# EAGLE design lighting (EAGLE 7.3.0)
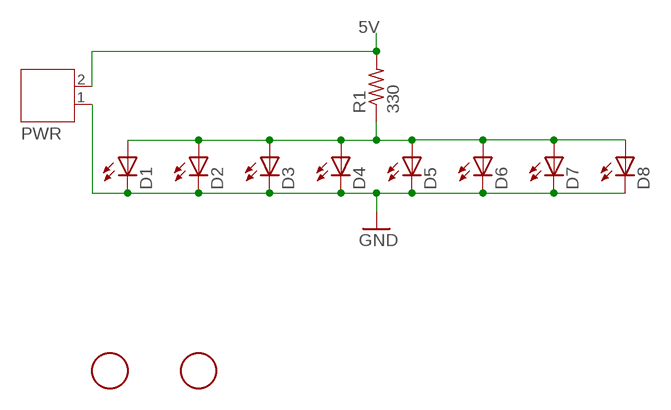
[diagram p0: schematic, sheet 1]

## Parts
D1  LEDCHIPLED_1206  [CHIPLED_1206]
D2  LEDCHIPLED_1206  [CHIPLED_1206]
D3  LEDCHIPLED_1206  [CHIPLED_1206]
D4  LEDCHIPLED_1206  [CHIPLED_1206]
D5  LEDCHIPLED_1206  [CHIPLED_1206]
D6  LEDCHIPLED_1206  [CHIPLED_1206]
D7  LEDCHIPLED_1206  [CHIPLED_1206]
D8  LEDCHIPLED_1206  [CHIPLED_1206]
PWR  JST-PH2  [JST-PH2]
R1  330  R-US_R1206  [R1206]
U$1  FIDUCIAL  [FIDUCIAL_1MM]
U$2  FIDUCIAL  [FIDUCIAL_1MM]

## Nets
5V: PWR.2 R1.2
COMMON: D1.A D2.A D3.A D4.A D5.A D6.A D7.A D8.A R1.1
GND: D1.C D2.C D3.C D4.C D5.C D6.C D7.C D8.C PWR.1

## Library data of the parts
D1-D8 = adafruit:LED: LED OSRAM: - CHIPLED LG R971, LG N971, LY N971, LG Q971, LY Q971, LO R971, LY R971 LH N974, LH R974 LS Q976, LO Q976, LY Q976 LO Q996 - Hyper CHIPLED LW Q18S LB Q993, LB Q99A, LB R99A - SideLED LS A670, LO A670, LY A670, LG A670, LP A670 LB A673, LV A673, LT A673, LW A673 LH A674 LY A675 LS A676, LA A676, LO A676, LY A676, LW A676 LS A679, LY A679, LG A679 - Hyper Micro SIDELED® LS Y876, LA Y876, LO Y876, LY Y876 LT Y87S - SmartLED LW L88C, LW L88S LB L89C, LB L89S, LG L890 LS L89K, LO L89K, LY L89K LS L896, LA L896, LO L896, LY L896 - TOPLED LS T670, LO T670, LY T670, LG T670, LP T670 LSG T670, LSP T670, LSY T670, LOP T670, LYG T670 LG T671, LOG T671, LSG T671 LB T673, LV T673, LT T673, LW T673 LH T674 LS T676, LA T676, LO T676, LY T676, LB T676, LH T676, LSB T676, LW T676 LB T67C, LV T67C, LT T67C, LS T67K, LO T67K, LY T67K, LW E67C LS E67B, LA E67B, LO E67B, LY E67B, LB E67C, LV E67C, LT E67C LW T67C LS T679, LY T679, LG T679 LS T770, LO T770, LY T770, LG T770, LP T770 LB T773, LV T773, LT T773, LW T773 LH T774 LS E675, LA E675, LY E675, LS T675 LS T776, LA T776, LO T776, LY T776, LB T776 LHGB T686 LT T68C, LB T68C - Hyper Mini TOPLED® LB M676 - Mini TOPLED Santana® LG M470 LS M47K, LO M47K, LY M47K Source: http://www.osram.convergy.de/
PWR = jst-ph:JST-PH2
R1 = adafruit:R-US_: RESISTOR, American symbol
U$1 U$2 = adafruit:FIDUCIAL: For use by pick and place machines to calibrate the vision/machine, 1mm By microbuilder.eu

## Board
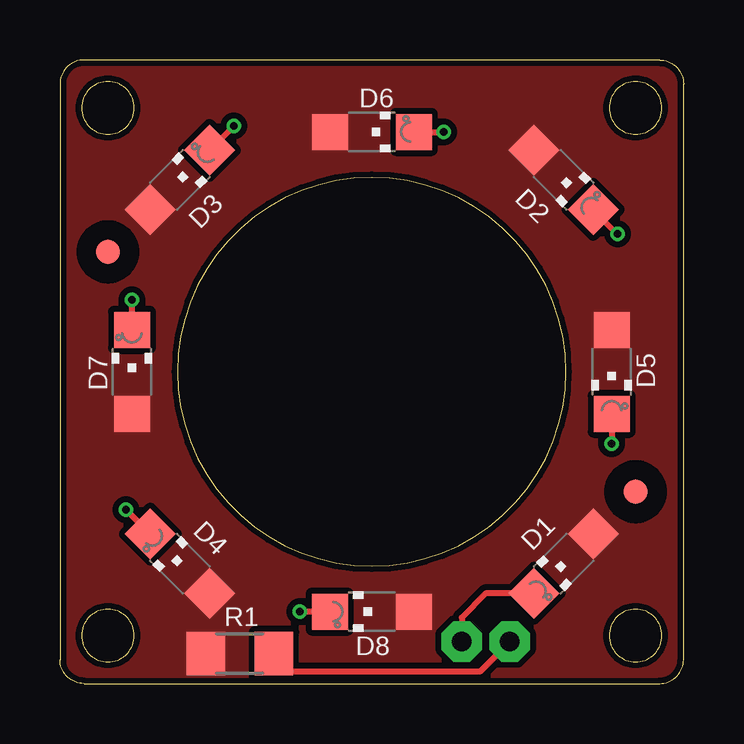
[diagram p1: board, top side]
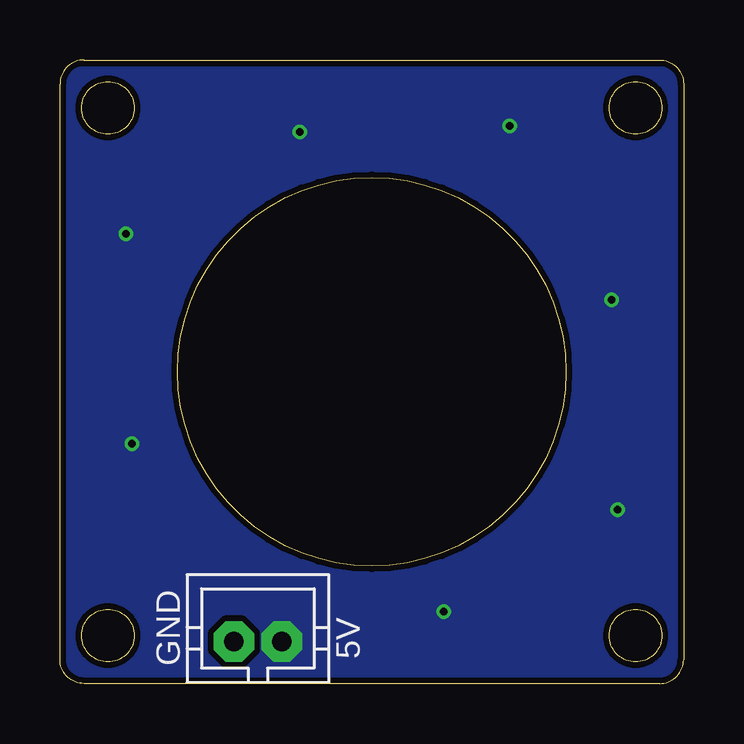
[diagram p2: board, bottom side, seen from below]

Size 26 x 26 mm. Coordinates in mm from the lower left corner, seen from the top.
Outline: 1,0 25,0 arc90 26,1 26,25 arc90 25,26 1,26 arc90 0,25 0,1 arc90 1,0
Outline: 2,3.1 arc90 0.9,2 arc90 2,0.9 arc90 3.1,2 arc90 2,3.1
Outline: 24,3.1 arc90 22.9,2 arc90 24,0.9 arc90 25.1,2 arc90 24,3.1
Outline: 2,25.1 arc90 0.9,24 arc90 2,22.9 arc90 3.1,24 arc90 2,25.1
Outline: 24,25.1 arc90 22.9,24 arc90 24,22.9 arc90 25.1,24 arc90 24,25.1
Outline: 13,21.1 arc90 4.9,13 arc90 13,4.9 arc90 21.1,13 arc90 13,21.1
Copper layers (1*16): Top 0.035mm / dielectric 1.5mm / Bottom 0.035mm
Design rules "default": minimum track width 6mil, minimum drill 0.3mm, track to track 6mil, track to pad 6mil, pad to pad 6mil, via to via 6mil, smd to smd 0mil, copper to edge 0.25mm, drill to drill 0.25mm, minimum pad ring 10mil, minimum via ring 6mil, stop-mask expansion 2mil, vias tented up to drill 100mil, thermal gap 10mil
tKeepout: area 22,0 to 26,4; area 22,22 to 26,26; area 0,22 to 4,26; area 0,0 to 4,4

### Footprints (pad centres in the part's own frame; a part is rotated, then mirrored left to right if it is on the bottom)
CHIPLED_1206 = smd 1.5 x 1.5: A 0,-1.75; C 0,1.75
JST-PH2 = drill 0.813 pad 1.676 octagon: 1 1,0; 2 -1,0
R1206 = smd 1.6 x 1.803: 1 -1.422,0; 2 1.422,0
FIDUCIAL_1MM = smd 1 x 1: 1 0,0

### Placement (x,y rotation side)
D1  21,5 135 top
D2  21,21 225 top
D3  5,21 315 top
D4  5,5 45 top
D5  23,13 180 top
D6  13,23 270 top
D7  3,13 0 top
D8  13,3 90 top
PWR  17.75,1.75 0 bottom
R1  7.5,1.25 0 top
U$1  2,18 0 top
U$2  24,8 0 top

### Tracks (layer width: path | path; a pad name or v marks a point on that pad's centre or on a via)
5V
  Top 0.25: PWR.2 17.5,0.5 9.67,0.5 R1.2
COMMON
  pour Top (isolate 0.25, rank 6, no thermals): 0,0 26,0 26,26 0,26
GND  (via drill 0.3)
  Top 0.25: D4.C v2.75,7.25 | v2.75,7.25 | D7.C v3,16 | D3.C v7.25,23.25 | D6.C v16,23 | D2.C v23.25,18.75 | v23.25,18.75 | D5.C v23,10 | D8.C v10,3 | D1.C 17.76,3.76 16.75,2.75 PWR.1
  pour Bottom (isolate 0.25, rank 6, no thermals): 0,0 26,0 26,26 0,26

### Text on the board
bNames: 5V | GND